# Altium project LIN_Controller_Board.PrjPcb
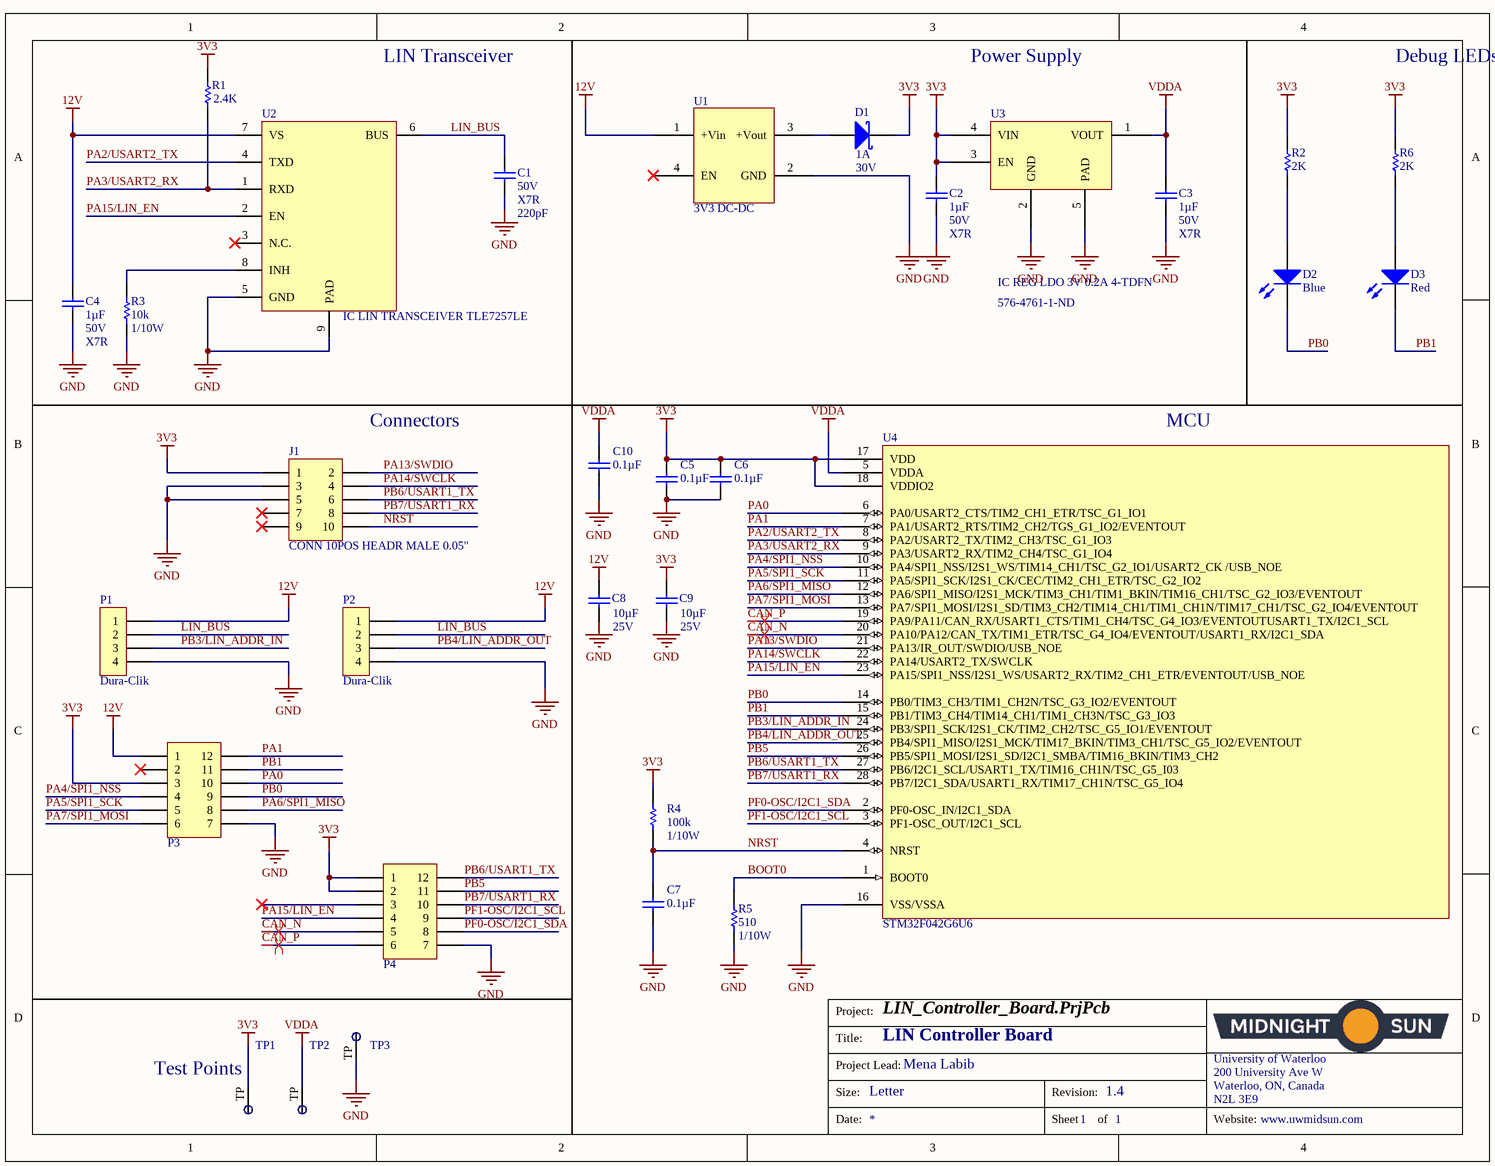
[diagram p0: LIN_Controller_Board.SchDoc]
ProjectRevision: 1.4; ProjectAuthor: Mena Labib
1 sheet, 31 parts. Net scope: global (net labels, ports and power ports of the same name join across sheets).
Board file: LIN_Controller_Board.PcbDoc

## Sheet LIN_Controller_Board.SchDoc: LIN Controller Board
size Letter; Organization: Midnight Sun Solar Rayce Car Team; Address1: University of Waterloo; Address2: 200 University Ave W; Address3: Waterloo, ON, Canada; Address4: N2L 3E9; Revision: 1.3; SheetNumber: 1; SheetTotal: 1; Website: www.uwmidsun.com

### Parts
C1  value 220pF  Voltage - Rated: 50V  Temperature Coefficient: X7R  [CAP, 0603]  (hidden comment: CAP CER 220PF 50V 5% X7R 0603)
C2  Capacitance: 1µF  Voltage: 50V  Temperature Coefficient: X7R  [CAP, 0603]  (hidden comment: CAP CER 1UF 50V 10% X7R 0603)
C3  Capacitance: 1µF  Voltage: 50V  Temperature Coefficient: X7R  [CAP, 0603]  (hidden comment: CAP CER 1UF 50V 10% X7R 0603)
C4  Capacitance: 1µF  Voltage: 50V  Temperature Coefficient: X7R  [CAP, 0603]  (hidden comment: CAP CER 1UF 50V 10% X7R 0603)
C5  Capacitance: 0.1µF  [CAP, 0603]  (hidden comment: CAP CER 0.1UF 50V 10% X7R 0603)
C6  Capacitance: 0.1µF  [CAP, 0603]  (hidden comment: CAP CER 0.1UF 50V 10% X7R 0603)
C7  Capacitance: 0.1µF  [CAP, 0603]  (hidden comment: CAP CER 0.1UF 50V 10% X7R 0603)
C8  Voltage - Rated: 25V  Capacitance: 10µF  [CAP, 0805]  (hidden comment: CAP CER 10uF 25V 10% X5R 0805)
C9  Voltage - Rated: 25V  Capacitance: 10µF  [CAP, 0805]  (hidden comment: CAP CER 10uF 25V 10% X5R 0805)
C10  Capacitance: 0.1µF  [CAP, 0603]  (hidden comment: CAP CER 0.1UF 50V 10% X7R 0603)
D1  Current - Average Rectified (Io): 1A  Voltage - DC Reverse (Vr) (Max): 30V  [DIODE SCHOTTKY 30V 1A POWERDI123]  (hidden comment: DIODE SCHOTTKY 30V 1A POWERDI123)
D2  Color: Blue  [LED_0603]  (hidden comment: LED BLUE CLEAR 2.8V 0603)
D3  Color: Red  [LED_0603]  (hidden comment: LED BLUE CLEAR 2.8V 0603)
J1  CONN 10POS HEADR MALE 0.05"  [CONN, 10POS 0.05" Debug Header]
P1  Dura-Clik  [CONN, 4POS DURA-CLIK VERT]
P2  Dura-Clik  [CONN, 4POS DURA-CLIK VERT]
P3  CONN 12POS HEADER MALE 0.1"  [CONN, 12POS 0.100" HEADER]  (value not drawn)
P4  CONN 12POS HEADER MALE 0.1"  [CONN, 12POS 0.100" HEADER]  (value not drawn)
R1  value 2.4K  [RES, 0603]  (hidden comment: RES 2.4K OHM 1% 1/10W 0603)
R2  2K  [RES, 0603]
R3  Resistance: 10k  Power: 1/10W  [RES, 0603]  (hidden comment: RES 10K OHM 1% 1/10W 0603)
R4  Resistance: 100k  Power: 1/10W  [RES, 0603]  (hidden comment: RES 100K OHM 5% 1/8W 0603)
R5  Resistance: 510  Power: 1/10W  [RES, 0603]  (hidden comment: RES 510 OHM 5% 1/10W 0603)
R6  2K  [RES, 0603]
TP1  Test Point  [Test Point]  (value not drawn)
TP2  Test Point  [Test Point]  (value not drawn)
TP3  Test Point  [Test Point]  (value not drawn)
U1  IC DCDC 3.3V 0.5A 4-SMD  [IC DCDC 3.3V 0.5A 4-SMD]  (value not drawn)
U2  IC LIN TRANSCEIVER TLE7257LE  [IC LIN TRANSCEIVER TLE7257LE]
U3  IC REG LDO 3V 0.2A 4-TDFN  Supplier Part Number 1: 576-4761-1-ND  [IC REG LDO 3V 0.2A 4-TDFN]
U4  Manufacturer Part Number: STM32F042G6U6  [IC MCU 32BIT 32KB FLASH 28UFQFPN]  (hidden comment: IC MCU 32BIT 32KB FLASH 28UFQFPN)

### Nets
3V3: C2.1 C5.2 C6.2 C9.1 D1.2(K) J1.1 P3.3 P4.1 P4.2 R1.1 R2.1 R4.2 R6.1 TP1.TP U3.3(EN) U3.4(VIN) U4.17(VDD) U4.18(VDDIO2)
12V: C4.1 C8.1 P1.1 P2.1 P3.1 U1.1(+Vin) U2.7(VS)
GND: C1.2 C2.2 C3.2 C4.2 C5.1 C6.1 C7.1 C8.2 C9.2 C10.1 J1.3 J1.5 P1.4 P2.4 P3.7 P4.7 R3.2 R5.1 TP3.TP U1.2(GND) U2.5(GND) U2.9(PAD) U3.2(GND) U3.5(PAD) U4.16(VSS/VSSA)
VDDA: C3.1 C10.2 TP2.TP U3.1(VOUT) U4.5(VDDA)
BOOT0: R5.2 U4.1(BOOT0)
CAN_N: P4.5 U4.20(PA10/PA12/CAN_TX/TIM1_ETR/TSC_G4_IO4/EVENTOUT/USART1_RX/I2C1_SDA)
CAN_P: P4.6 U4.19(PA9/PA11/CAN_RX/USART1_CTS/TIM1_CH4/TSC_G4_IO3/EVENTOUTUSART1_TX/I2C1_SCL)
LIN_BUS: C1.1 P1.2 P2.2 U2.6(BUS)
NRST: C7.2 J1.10 R4.1 U4.4(NRST)
PA0: P3.10 U4.6(PA0/USART2_CTS/TIM2_CH1_ETR/TSC_G1_IO1)
PA1: P3.12 U4.7(PA1/USART2_RTS/TIM2_CH2/TGS_G1_IO2/EVENTOUT)
PA2/USART2_TX: U2.4(TXD) U4.8(PA2/USART2_TX/TIM2_CH3/TSC_G1_IO3)
PA3/USART2_RX: R1.2 U2.1(RXD) U4.9(PA3/USART2_RX/TIM2_CH4/TSC_G1_IO4)
PA4/SPI1_NSS: P3.4 U4.10(PA4/SPI1_NSS/I2S1_WS/TIM14_CH1/TSC_G2_IO1/USART2_CK_/USB_NOE)
PA5/SPI1_SCK: P3.5 U4.11(PA5/SPI1_SCK/I2S1_CK/CEC/TIM2_CH1_ETR/TSC_G2_IO2)
PA6/SPI1_MISO: P3.8 U4.12(PA6/SPI1_MISO/I2S1_MCK/TIM3_CH1/TIM1_BKIN/TIM16_CH1/TSC_G2_IO3/EVENTOUT)
PA7/SPI1_MOSI: P3.6 U4.13(PA7/SPI1_MOSI/I2S1_SD/TIM3_CH2/TIM14_CH1/TIM1_CH1N/TIM17_CH1/TSC_G2_IO4/EVENTOUT)
PA13/SWDIO: J1.2 U4.21(PA13/IR_OUT/SWDIO/USB_NOE)
PA14/SWCLK: J1.4 U4.22(PA14/USART2_TX/SWCLK)
PA15/LIN_EN: P4.4 U2.2(EN) U4.23(PA15/SPI1_NSS/I2S1_WS/USART2_RX/TIM2_CH1_ETR/EVENTOUT/USB_NOE)
PB0: D2.2(K) P3.9 U4.14(PB0/TIM3_CH3/TIM1_CH2N/TSC_G3_IO2/EVENTOUT)
PB1: D3.2(K) P3.11 U4.15(PB1/TIM3_CH4/TIM14_CH1/TIM1_CH3N/TSC_G3_IO3)
PB3/LIN_ADDR_IN: P1.3 U4.24(PB3/SPI1_SCK/I2S1_CK/TIM2_CH2/TSC_G5_IO1/EVENTOUT)
PB4/LIN_ADDR_OUT: P2.3 U4.25(PB4/SPI1_MISO/I2S1_MCK/TIM17_BKIN/TIM3_CH1/TSC_G5_IO2/EVENTOUT)
PB5: P4.11 U4.26(PB5/SPI1_MOSI/I2S1_SD/I2C1_SMBA/TIM16_BKIN/TIM3_CH2)
PB6/USART1_TX: J1.6 P4.12 U4.27(PB6/I2C1_SCL/USART1_TX/TIM16_CH1N/TSC_G5_I03)
PB7/USART1_RX: J1.8 P4.10 U4.28(PB7/I2C1_SDA/USART1_RX/TIM17_CH1N/TSC_G5_IO4)
PF0-OSC/I2C1_SDA: P4.8 U4.2(PF0-OSC_IN/I2C1_SDA)
PF1-OSC/I2C1_SCL: P4.9 U4.3(PF1-OSC_OUT/I2C1_SCL)
NetD1_1: D1.1(A) U1.3(+Vout)
NetD2_1: D2.1(A) R2.2
NetD3_1: D3.1(A) R6.2
NetR3_1: R3.1 U2.8(INH)

Not connected (* = marked no-connect by the designer): J1 7* 9*; P3 2*; P4 3*; U1 4(EN)*; U2 3(N.C.)*

### Layout directives
differential pair: CAN_N, CAN_P

### Notes on the sheet
- (near R1) LIN Transceiver
- Power Supply
- Debug LEDs
- (near J1) Connectors
- MCU
- Test Points
- Project:
- Title:
- Size:
- Project Lead:
- Letter
- Revision:
- University of Waterloo
- 200 University Ave W
- Waterloo, ON, Canada
- N2L 3E9
- Date:
- Sheet
- of
- Website:
- (in symbol IC DCDC 3.3V 0.5A 4-SMD) 3V3 DC-DC

### Library data of the parts
C1 = CAP CER 220PF 50V 5% X7R 0603: 220pF ±5% 50V Ceramic Capacitor X7R 0603 (1608 Metric); Manufacturer: Murata Electronics North America; Manufacturer Part Number: GRM188R71H221JA01D; Notification: Current market demand for these product types have resulted in fluctuating and extending lead times. Lead times may differ.; Supplier 1: Digi-Key; RoHS: RoHS Compliant; Category: Capacitors; Stock 1: 42692; Pricing 1: 1=0.14, 10=0.093, 100=0.0413, 500=0.0295, 1000=0.02317 (CAD); Packaging: Cut Tape (CT); Part Status: Active; Operating Temperature: -55°C ~ 125°C; Features: -; Ratings: -; Applications: General Purpose; Mounting Type: Surface Mount, MLCC; Package / Case: 0603 (1608 Metric); Size / Dimension: 0.063" L x 0.032" W (1.60mm x 0.80mm); Height - Seated (Max): -; Thickness (Max): 0.035" (0.90mm); Lead Spacing: -; Lead Style: -; ComponentLink1URL: http://search.murata.co.jp/Ceramy/image/img/A01X/G101/ENG/GRM188R71H221JA01-01.pdf; ComponentLink1Description: http://search.murata.co.jp/Ceramy/image/img/A01X/G101/ENG/GRM188R71H221JA01-01.pdf; Supplier Part Number 1: 490-12545-1-ND; Tolerance: ±5%
C2-C4 = CAP CER 1UF 50V 10% X7R 0603: 1µF ±10% 50V Ceramic Capacitor X7R 0603 (1608 Metric); Manufacturer 1: Taiyo Yuden; Manufacturer Part Number 1: UMK107AB7105KA-T; Supplier 1: Digi-Key; Supplier Part Number 1: 587-3247-1-ND; Packaging: Cut Tape (CT); Part Status: Active; Operating Temperature: -55°C ~ 125°C; Ratings: -; Mounting Type: Surface Mount, MLCC; Package / Case: 0603 (1608 Metric); Size / Dimension: 0.063" L x 0.031" W (1.60mm x 0.80mm); Height - Seated (Max): -; Thickness (Max): 0.037" (0.95mm); Lead Spacing: -; Lead Style: -; ComponentLink1URL: http://www.yuden.co.jp/productdata/catalog/en/mlcc_all_e.pdf; ComponentLink1Description: http://www.yuden.co.jp/productdata/catalog/en/mlcc_all_e.pdf; Tolerance: ±10%
C5-C7 C10 = CAP CER 0.1UF 50V 10% X7R 0603: 0.10µF ±10% 50V Ceramic Capacitor X7R 0603 (1608 Metric); Manufacturer 1: AVX Corporation; Manufacturer Part Number 1: 06035C104KAT2A; Voltage: 50V; Supplier 1: Digi-Key; Supplier Part Number 1: 478-5052-1-ND; Packaging: Cut Tape (CT); Part Status: Active; Operating Temperature: -55°C ~ 125°C; Ratings: -; Mounting Type: Surface Mount, MLCC; Package / Case: 0603 (1608 Metric); Size / Dimension: 0.063" L x 0.032" W (1.60mm x 0.81mm); Height - Seated (Max): -; Thickness (Max): 0.035" (0.90mm); Lead Spacing: -; Lead Style: -; ComponentLink1URL: http://datasheets.avx.com/X7RDielectric.pdf; ComponentLink1Description: http://datasheets.avx.com/X7RDielectric.pdf; Tolerance: ±10%; Temperature Coefficient: X7R
C8 C9 = CAP CER 10uF 25V 10% X5R 0805: 10µF ±10% 25V Ceramic Capacitor X5R 0805 (2012 Metric); Manufacturer: Murata Electronics North America; Manufacturer Part Number: GRM21BR61E106KA73L; Supplier 1: Digi-Key; RoHS: RoHS Compliant; Category: Capacitors; Stock 1: 1695157; Packaging: Cut Tape (CT); Part Status: Active; Tolerance: ±10%; Temperature Coefficient: X5R; Operating Temperature: -55°C ~ 85°C; Features: -; Ratings: -; Applications: General Purpose; Mounting Type: Surface Mount, MLCC; Package / Case: 0805 (2012 Metric); Size / Dimension: 0.079" L x 0.049" W (2.00mm x 1.25mm); Height - Seated (Max): -; Thickness (Max): 0.053" (1.35mm); Lead Spacing: -; Lead Style: -; ComponentLink1URL: http://search.murata.co.jp/Ceramy/image/img/A01X/G101/ENG/GRM21BR61E106KA73-01.pdf; ComponentLink1Description: http://search.murata.co.jp/Ceramy/image/img/A01X/G101/ENG/GRM21BR61E106KA73-01.pdf; Supplier Part Number 1: 490-5523-1-ND; Pricing 1: 1=0.3, 10=0.214, 100=0.1008, 500=0.07068, 1000=0.05851 (CAD)
D1 = DIODE SCHOTTKY 30V 1A POWERDI123: Diode Schottky 30V 1A Surface Mount PowerDI™ 123; Manufacturer: Diodes Incorporated; Manufacturer Part Number: DFLS130L-7; Speed: Fast Recovery =< 500ns, > 200mA (Io); Current - Reverse Leakage @ Vr: 1mA @ 30V; Capacitance @ Vr, F: 76pF @ 10V, 1MHz; Voltage - Forward (Vf) (Max) @ If: 310mV @ 1A; Supplier 1: Digi-Key; RoHS: RoHS Compliant; Category: Discrete Semiconductor Products; Stock 1: 68200; Packaging: Cut Tape (CT); Part Status: Active; Diode Type: Schottky; Mounting Type: Surface Mount; Package / Case: POWERDI®123; Supplier Device Package: PowerDI™ 123; Operating Temperature - Junction: -40°C ~ 125°C; ComponentLink1URL: https://www.diodes.com/assets/Datasheets/ds30492.pdf; ComponentLink1Description: https://www.diodes.com/assets/Datasheets/ds30492.pdf; Supplier Part Number 1: DFLS130LDICT-ND; Pricing 1: 1=0.7, 10=0.599, 100=0.447, 500=0.35126, 1000=0.27142 (CAD)
D2 D3 = LED BLUE CLEAR 2.8V 0603: Blue 470nm LED Indication - Discrete 2.8V 0603 (1608 Metric); Manufacturer 1: Lite-On Inc.; Manufacturer Part Number 1: LTST-C193TBKT-5A; Lens Color: Colorless; Millicandela Rating: 15mcd; Lens Style/Size: Rectangle with Flat Top, 1.15mm x 0.80mm; Current - Test: 5mA; Viewing Angle: 130°; Wavelength - Peak: 468nm; Supplier 1: Digi-Key; Supplier Part Number 1: 160-1827-1-ND; Packaging: Cut Tape (CT); Part Status: Active; Lens Transparency: Clear; Mounting Type: Surface Mount; Wavelength - Dominant: 470nm; Package / Case: 0603 (1608 Metric); Supplier Device Package: Chip LED; Size / Dimension: 1.60mm L x 0.80mm W; Height (Max): 0.45mm; ComponentLink1URL: http://optoelectronics.liteon.com/upload/download/DS22-2004-060/P_100_LTST-C193TBKT-5A.pdf; ComponentLink1Description: http://optoelectronics.liteon.com/upload/download/DS22-2004-060/P_100_LTST-C193TBKT-5A.pdf; Voltage - Forward (Vf) (Typ): 2.8V
J1 = CONN 10POS HEADR MALE 0.05": 10 Positions Header Connector 0.050" (1.27mm) Surface Mount Gold; Manufacturer 1: Amphenol FCI; Manufacturer Part Number 1: 20021121-00010C4LF; Style: Board to Board; Shrouding: Unshrouded; Number of Positions: 10; Number of Positions Loaded: All; Contact Length - Mating: 0.120" (3.05mm); Material Flammability Rating: UL94 V-0; Supplier 1: Digi-Key; Supplier Part Number 1: 609-3695-1-ND; Packaging: Cut Tape (CT); Part Status: Active; Connector Type: Header; Contact Type: Male Pin; Number of Rows: 2; Row Spacing - Mating: 0.050" (1.27mm); Mounting Type: Surface Mount; Termination: Solder; Fastening Type: -; Contact Length - Post: -; Overall Contact Length: -; Insulation Height: -; Contact Shape: Square; Contact Finish - Mating: Gold; Contact Finish Thickness - Mating: 10µin (0.25µm); Contact Finish - Post: Tin; Contact Material: Copper Alloy; Insulation Material: Thermoplastic; Operating Temperature: -; Ingress Protection: -; Insulation Color: Black; Current Rating: -; Mated Stacking Heights: -; Contact Finish Thickness - Post: 50µin (1.27µm); ComponentLink1URL: http://portal.fciconnect.com/Comergent//fci/drawing/20021121.pdf; ComponentLink1Description: http://portal.fciconnect.com/Comergent//fci/drawing/20021121.pdf; Voltage: -; Pitch - Mating: 0.050" (1.27mm)
P1 P2 = CONN 4POS DURA-CLIK 0.079": 4 Positions Header Connector 0.079" (2.00mm) Surface Mount Tin; Manufacturer: Molex, LLC; Manufacturer Part Number: 5600200420; Style: Board to Cable/Wire; Shrouding: Shrouded - 4 Wall; Number of Positions: 4; Number of Positions Loaded: All; Mated Stacking Heights: 9.3mm; Supplier 1: Digi-Key; RoHS: RoHS Compliant; Category: Connectors, Interconnects; Stock 1: 9367; Pricing 1: 1=2.23, 10=2.022, 25=1.898, 50=1.8156, 100=1.733 (CAD); Packaging: Cut Tape (CT); Part Status: Active; Connector Type: Header; Contact Type: Male Pin; Pitch - Mating: 0.079" (2.00mm); Number of Rows: 1; Row Spacing - Mating: -; Mounting Type: Surface Mount; Termination: Solder; Fastening Type: Latch Lock; Contact Length - Mating: -; Contact Length - Post: -; Overall Contact Length: -; Insulation Height: 0.315" (8.00mm); Contact Shape: Square; Contact Finish - Mating: Tin; Contact Finish Thickness - Mating: -; Contact Finish - Post: Tin; Contact Material: Copper Alloy; Insulation Material: Polyamide (PA), Nylon; Features: Solder Retention; Operating Temperature: -; Ingress Protection: -; Material Flammability Rating: -; Insulation Color: Natural; Current Rating: -; Voltage Rating: -; Contact Finish Thickness - Post: -; Applications: Automotive, Industrial; ComponentLink1URL: http://www.molex.com/pdm_docs/sd/5600200420_sd.pdf; ComponentLink1Description: http://www.molex.com/pdm_docs/sd/5600200420_sd.pdf; Supplier Part Number 1: WM10864CT-ND
P3 P4 = CONN 12POS HEADER MALE 0.1": 6 Positions Header Connector 0.100" (2.54mm) Through Hole Gold or Gold, GXT; Manufacturer: Amphenol FCI; Manufacturer Part Number: 67997-206HLF; Number of Positions: 6; Number of Positions Loaded: All; Style: Board to Board; Shrouding: Unshrouded; Contact Length - Mating: 0.230" (5.84mm); Contact Length - Post: 0.120" (3.05mm); Overall Contact Length: 0.450" (11.43mm); Material Flammability Rating: UL94 V-0; Supplier 1: Digi-Key; RoHS: RoHS Compliant; Category: Connectors, Interconnects; Stock 1: 22830; Pricing 1: 1=0.43, 10=0.402, 100=0.2817, 500=0.24142, 1000=0.20118, 5000=0.17243, 10000=0.16094 (CAD); Packaging: Bulk; Part Status: Active; Connector Type: Header; Contact Type: Male Pin; Pitch - Mating: 0.100" (2.54mm); Number of Rows: 2; Row Spacing - Mating: 0.100" (2.54mm); Mounting Type: Through Hole; Termination: Solder; Fastening Type: Push-Pull; Insulation Height: 0.100" (2.54mm); Contact Shape: Square; Contact Finish - Mating: Gold or Gold, GXT™; Contact Finish Thickness - Mating: 15µin (0.38µm); Contact Finish - Post: -; Contact Material: Phosphor Bronze; Insulation Material: -; Features: -; Operating Temperature: -; Ingress Protection: -; Insulation Color: Black; Current Rating: -; Voltage Rating: -; Mated Stacking Heights: -; Contact Finish Thickness - Post: -; Applications: -; ComponentLink1URL: http://cdn.amphenol-icc.com/media/wysiwyg/files/drawing/67996.pdf; ComponentLink1Description: http://cdn.amphenol-icc.com/media/wysiwyg/files/drawing/67996.pdf; Supplier Part Number 1: 609-3234-ND
R1 = RES 2.4K OHM 1% 1/10W 0603: 2.4 kOhms ±1% 0.1W, 1/10W Chip Resistor 0603 (1608 Metric) Moisture Resistant Thick Film; Manufacturer: Yageo; Manufacturer Part Number: RC0603FR-072K4L; Temperature Coefficient: ±100ppm/°C; Supplier 1: Digi-Key; RoHS: RoHS Compliant; Category: Resistors; Stock 1: 644006; Pricing 1: 1=0.15, 10=0.022, 100=0.0089, 1000=0.00396, 2500=0.00344 (CAD); Packaging: Cut Tape (CT); Part Status: Active; Composition: Thick Film; Features: Moisture Resistant; Operating Temperature: -55°C ~ 155°C; Package / Case: 0603 (1608 Metric); Supplier Device Package: 0603; Size / Dimension: 0.063" L x 0.032" W (1.60mm x 0.80mm); Height - Seated (Max): 0.022" (0.55mm); Failure Rate: -; ComponentLink1URL: http://www.yageo.com/documents/recent/PYu-RC_Group_51_RoHS_L_8.pdf; ComponentLink1Description: http://www.yageo.com/documents/recent/PYu-RC_Group_51_RoHS_L_8.pdf; Supplier Part Number 1: 311-2.40KHRCT-ND; Power (Watts): 0.1W, 1/10W; Tolerance: ±1%
R2 R6 = RES 2K OHM 1% 1/10W 0603: 2k Ohm ±1% 0.1W, 1/10W Chip Resistor 0603 (1608 Metric) Moisture Resistant Thick Film; Manufacturer: Yageo; Manufacturer Part Number: RC0603FR-072KL; Temperature Coefficient: ±100ppm/°C; Supplier 1: Digi-Key; RoHS: RoHS Compliant; Category: Resistors; Stock 1: 1750701; Pricing 1: 1=0.15, 10=0.023, 100=0.0093, 1000=0.00415, 2500=0.0036 (CAD); Packaging: Cut Tape (CT); Part Status: Active; Resistance (Ohms): 2k; Tolerance: ±1%; Power (Watts): 0.1W, 1/10W; Composition: Thick Film; Features: Moisture Resistant; Operating Temperature: -55°C ~ 155°C; Package / Case: 0603 (1608 Metric); Supplier Device Package: 0603; Size / Dimension: 0.063" L x 0.031" W (1.60mm x 0.80mm); Height - Seated (Max): 0.022" (0.55mm); Failure Rate: -; ComponentLink1URL: http://www.yageo.com/documents/recent/PYu-RC_Group_51_RoHS_L_7.pdf; ComponentLink1Description: http://www.yageo.com/documents/recent/PYu-RC_Group_51_RoHS_L_7.pdf
R3 = RES 10K OHM 1% 1/10W 0603: RES SMD 10K OHM 1% 1/10W 0603; Manufacturer 1: Yageo; Manufacturer Part Number 1: RC0603FR-0710KL; Temperature Coefficient: ±100ppm/°C; Supplier 1: Digi-Key; Supplier Part Number 1: 311-10.0KHRCT-ND; Packaging: Cut Tape (CT); Part Status: Active; Composition: Thick Film; Operating Temperature: -55°C ~ 155°C; Package / Case: 0603 (1608 Metric); Supplier Device Package: 0603; Size / Dimension: 0.063" L x 0.031" W (1.60mm x 0.80mm); Height - Seated (Max): 0.022" (0.55mm); Failure Rate: -; ComponentLink1URL: http://www.yageo.com/documents/recent/PYu-RC_Group_51_RoHS_L_7.pdf; ComponentLink1Description: http://www.yageo.com/documents/recent/PYu-RC_Group_51_RoHS_L_7.pdf; Tolerance: ±1%
R4 = RES 100K OHM 5% 1/8W 0603: RES SMD 100K OHM 5% 1/10W 0603; Manufacturer 1: Yageo; Manufacturer Part Number 1: RC0603JR-07100KL; Temperature Coefficient: ±100ppm/°C; Supplier 1: Digi-Key; Supplier Part Number 1: 311-100KGRCT-ND; Packaging: Cut Tape (CT); Part Status: Active; Composition: Thick Film; Operating Temperature: -55°C ~ 155°C; Package / Case: 0603 (1608 Metric); Supplier Device Package: 0603; Size / Dimension: 0.063" L x 0.031" W (1.60mm x 0.80mm); Height - Seated (Max): 0.022" (0.55mm); Failure Rate: -; ComponentLink1URL: http://www.yageo.com/documents/recent/PYu-RC_Group_51_RoHS_L_7.pdf; ComponentLink1Description: http://www.yageo.com/documents/recent/PYu-RC_Group_51_RoHS_L_7.pdf; Tolerance: ±5%
R5 = RES 510 OHM 5% 1/10W 0603: RES SMD 510 OHM 5% 1/10W 0603; Manufacturer 1: Yageo; Manufacturer Part Number 1: RC0603JR-07510RL; Temperature Coefficient: ±100ppm/°C; Supplier 1: Digi-Key; Supplier Part Number 1: 311-510GRCT-ND; Packaging: Cut Tape (CT); Part Status: Active; Composition: Thick Film; Operating Temperature: -55°C ~ 155°C; Package / Case: 0603 (1608 Metric); Supplier Device Package: 0603; Size / Dimension: 0.063" L x 0.031" W (1.60mm x 0.80mm); Height - Seated (Max): 0.022" (0.55mm); Failure Rate: -; ComponentLink1URL: http://www.yageo.com/documents/recent/PYu-RC_Group_51_RoHS_L_7.pdf; ComponentLink1Description: http://www.yageo.com/documents/recent/PYu-RC_Group_51_RoHS_L_7.pdf; Tolerance: ±5%
U1 = IC DCDC 3.3V 0.5A 4-SMD: Non-isolated PoL DC-DC Module 3.3V Output 0.5A 5-36V Input; Manufacturer: Recom Power; Manufacturer Part Number: ROF-78E3.3-0.5SMD-R; Number of Outputs: 1; Voltage - Input (Min): 5V; Voltage - Input (Max): 36V; Current - Output (Max): 500mA; Efficiency: 84%; Supplier 1: Digi-Key; RoHS: RoHS Compliant; Category: Power Supplies - Board Mount; Stock 1: 2290; Packaging: Cut Tape (CT); Part Status: Active; Type: Non-Isolated PoL Module; Voltage - Output 1: 3.3V; Voltage - Output 2: -; Voltage - Output 3: -; Voltage - Isolation: -; Applications: ITE (Commercial); Features: SCP; Operating Temperature: -40°C ~ 75°C; Mounting Type: Surface Mount; Package / Case: 4-SMD Module; Size / Dimension: 0.53" L x 0.49" W x 0.18" H (13.5mm x 12.5mm x 4.5mm); ComponentLink1URL: https://www.recom-power.com/pdf/Innoline/ROF-78Exx-0.5.pdf; ComponentLink1Description: https://www.recom-power.com/pdf/Innoline/ROF-78Exx-0.5.pdf; Supplier Part Number 1: 945-1689-1-ND; Pricing 1: 1=4.97, 5=4.906, 10=4.836, 25=4.6944, 50=4.5516, 100=4.4094, 250=4.26728 (CAD)
U2 = IC LIN TRANSCEIVER TLE7257LE: 1/1 Transceiver LIN PG-TSON-8; Manufacturer: Infineon Technologies; Manufacturer Part Number: TLE7257LEXUMA1; Data Rate: 20kbps; Voltage - Supply: 5.5 V ~ 18 V; Supplier 1: Digi-Key; RoHS: RoHS Compliant; Category: Integrated Circuits (ICs); Stock 1: 1710; Pricing 1: 1=1.3, 10=1.14, 100=0.8742, 500=0.69104, 1000=0.55284 (CAD); Packaging: Cut Tape (CT); Part Status: Active; Type: Transceiver; Protocol: LIN; Number of Drivers/Receivers: 1/1; Duplex: -; Operating Temperature: -40°C ~ 150°C; Mounting Type: Surface Mount; Package / Case: 8-TDFN Exposed Pad; Supplier Device Package: PG-TSON-8; ComponentLink1URL: https://www.infineon.com/dgdl/Infineon-TLE7257-DS-v01_10-EN.pdf?fileId=5546d46259d9a4bf015a3d00335b5e7d; ComponentLink1Description: https://www.infineon.com/dgdl/Infineon-TLE7257-DS-v01_10-EN.pdf?fileId=5546d46259d9a4bf015a3d00335b5e7d; Supplier Part Number 1: TLE7257LEXUMA1CT-ND
U3 = IC REG LDO 3V 0.2A 4-TDFN: Manufacturer: Microchip Technology; Manufacturer Part Number: MIC94310-PYMT-TR; Regulator Topology: Positive Fixed; Current - Output: 200mA; Voltage - Dropout (Typical): 0.04V @ 200mA; Voltage - Input: Up to 3.6V; Current - Limit (Min): 250mA; Supplier 1: Digi-Key; RoHS: RoHS Compliant; Category: Integrated Circuits (ICs); Stock 1: 4802; Pricing 1: 1=0.45, 25=0.3708, 100=0.3386 (CAD); Packaging: Cut Tape (CT); Part Status: Active; Voltage - Output: 3V; Operating Temperature: -40°C ~ 125°C; Mounting Type: Surface Mount; Package / Case: 4-UFDFN Exposed Pad; Supplier Device Package: 4-TDFN (1.2x1.6); ComponentLink1URL: http://www.microchip.com/mymicrochip/filehandler.aspx?ddocname=en580409; ComponentLink1Description: http://www.microchip.com/mymicrochip/filehandler.aspx?ddocname=en580409
U4 = IC MCU 32BIT 32KB FLASH 28UFQFPN: ARM® Cortex®-M0 STM32F0 Microcontroller IC 32-Bit 48MHz 32KB (32K x 8) FLASH 28-UFQFPN (4x4); Manufacturer: STMicroelectronics; Connectivity: CAN, HDMI-CEC, I²C, IrDA, LIN, SPI, UART/USART, USB; Peripherals: DMA, I²S, POR, PWM, WDT; RAM Size: 6K x 8; Voltage - Supply (Vcc/Vdd): 1.65 V ~ 3.6 V; Data Converters: A/D 13x12b; Oscillator Type: Internal; Supplier 1: Digi-Key; RoHS: RoHS Compliant; Category: Integrated Circuits (ICs); Stock 1: 902; Pricing 1: 1=3.62, 10=3.253, 100=2.6146, 500=2.14816, 1000=1.7799 (CAD); Packaging: Tray; Part Status: Active; Core Processor: ARM® Cortex®-M0; Core Size: 32-Bit; Speed: 48MHz; Program Memory Size: 32KB (32K x 8); Program Memory Type: FLASH; EEPROM Size: -; Operating Temperature: -40°C ~ 85°C (TA); Package / Case: 28-UFQFN Exposed Pad; Supplier Device Package: 28-UFQFPN (4x4); ComponentLink1URL: http://www.st.com/content/ccc/resource/technical/document/datasheet/52/ad/d0/80/e6/be/40/ad/DM00105814.pdf/files/DM00105814.pdf/jcr:content/translations/en.DM00105814.pdf; ComponentLink1Description: http://www.st.com/content/ccc/resource/technical/document/datasheet/52/ad/d0/80/e6/be/40/ad/DM00105814.pdf/files/DM00105814.pdf/jcr:content/translations/en.DM00105814.pdf; Supplier Part Number 1: 497-17345-ND